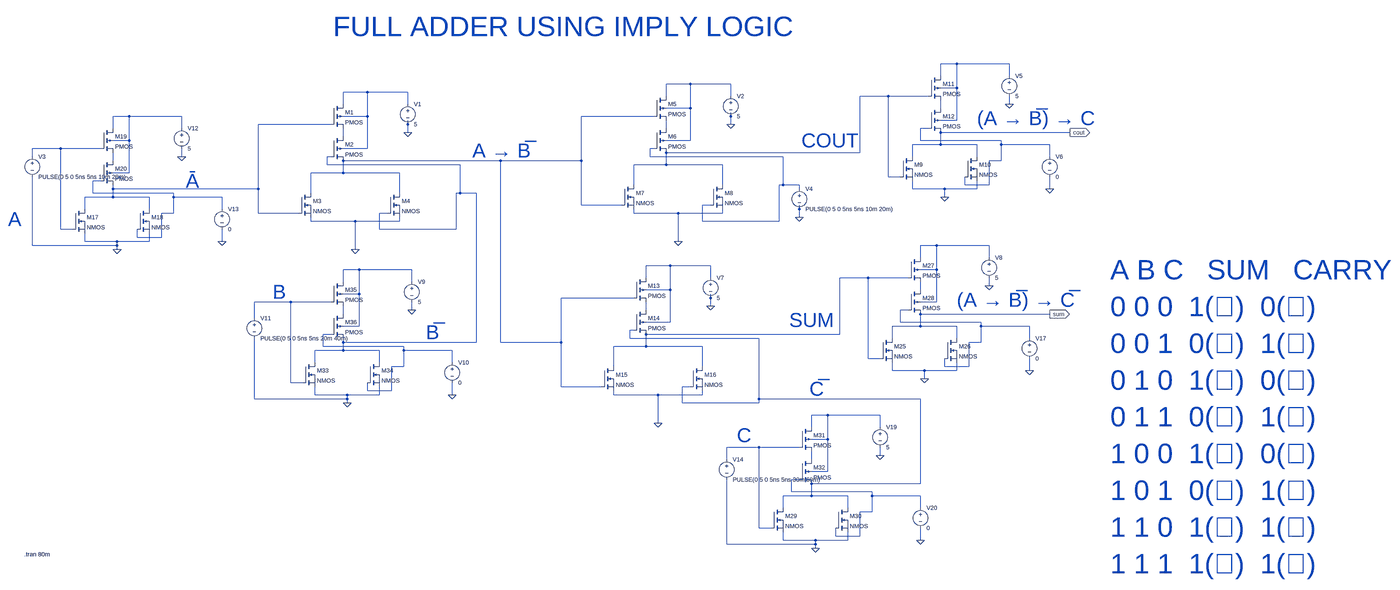
[diagram p0: schematic originalfulladderimply.asc, whole sheet]
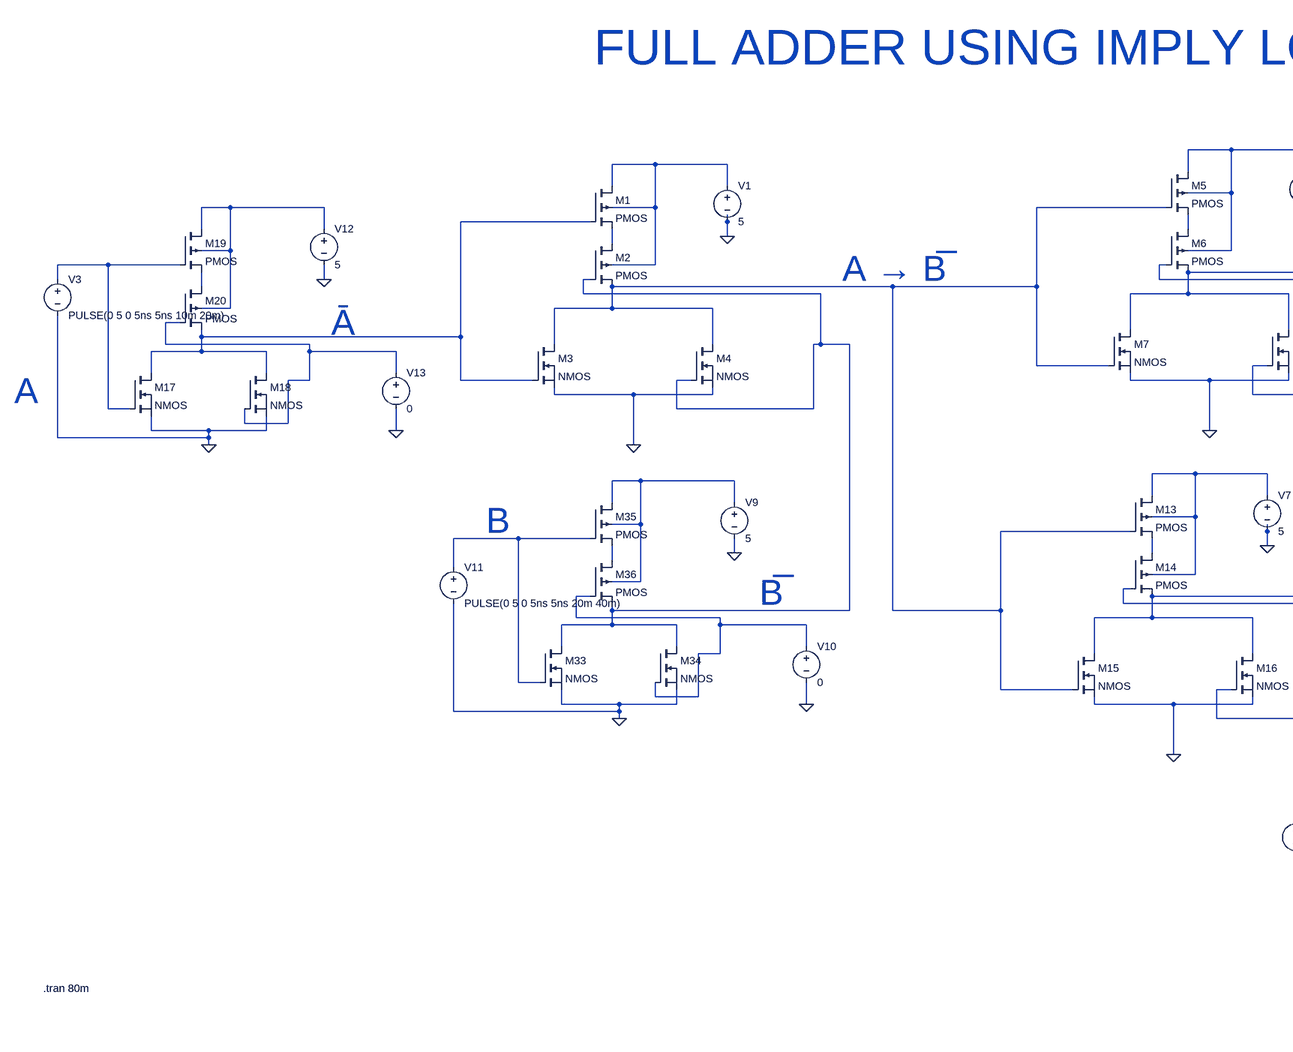
[diagram p1: schematic originalfulladderimply.asc, part, row 1 of 1, column 1 of 2]
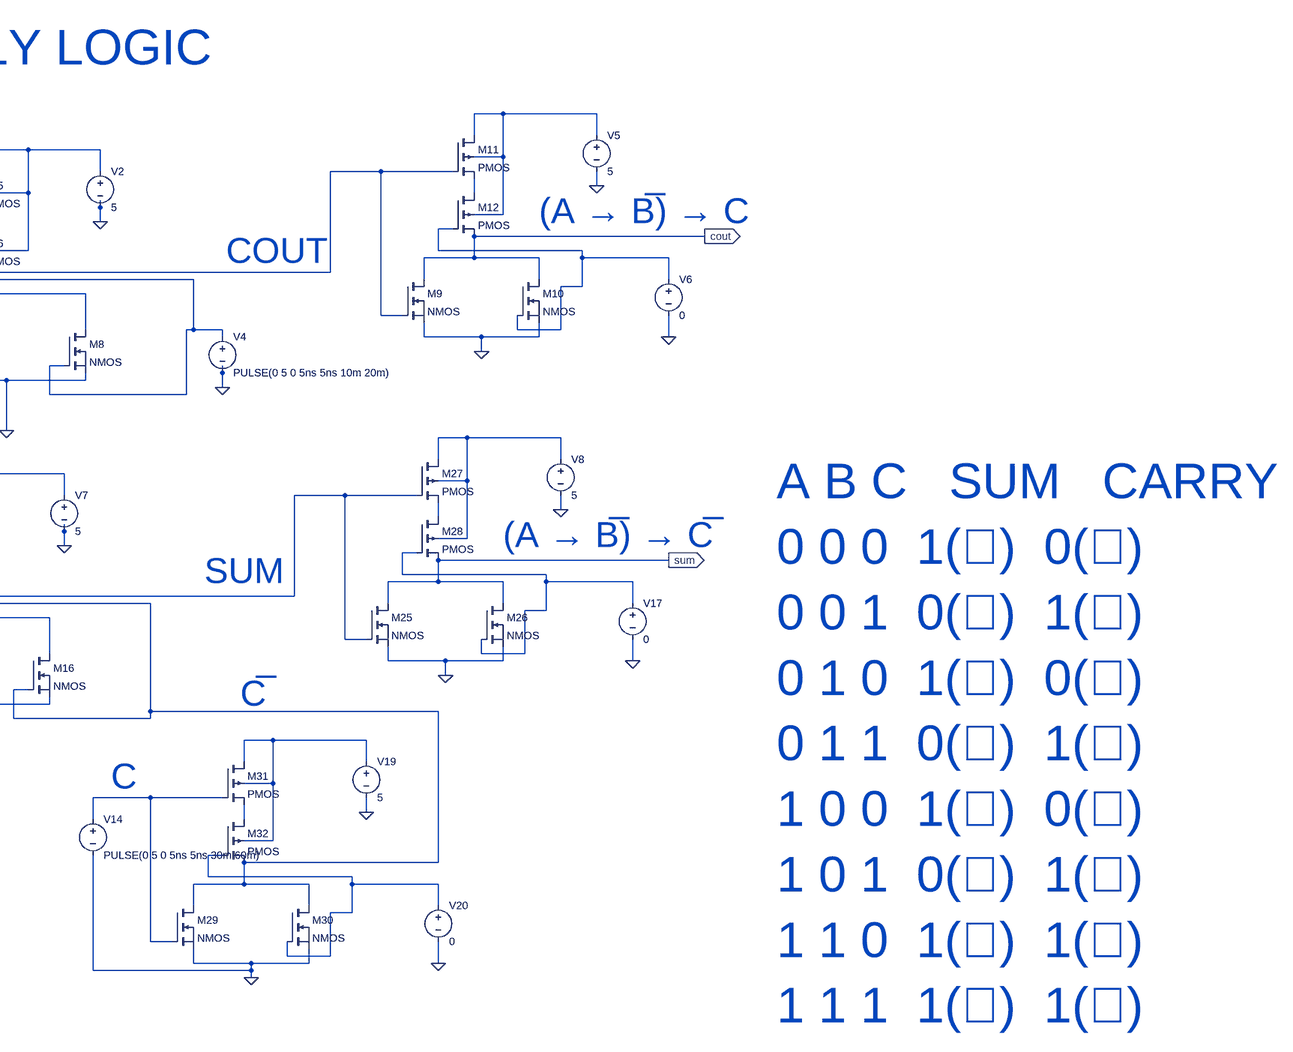
[diagram p2: schematic originalfulladderimply.asc, part, row 1 of 1, column 2 of 2]
originalfulladderimply.asc, the LTspice schematic file:
Version 4
SHEET 1 4968 3320
WIRE 1360 -464 1296 -464
WIRE 1568 -464 1360 -464
WIRE 1296 -416 1296 -464
WIRE 1568 -416 1568 -464
WIRE 304 -384 208 -384
WIRE 464 -384 304 -384
WIRE 1360 -368 1360 -464
WIRE 1360 -368 1296 -368
WIRE -976 -352 -1072 -352
WIRE -816 -352 -976 -352
WIRE 208 -336 208 -384
WIRE 464 -336 464 -384
WIRE 1088 -336 976 -336
WIRE 1248 -336 1088 -336
WIRE -1072 -304 -1072 -352
WIRE -816 -304 -816 -352
WIRE 1568 -304 1568 -336
WIRE 304 -288 304 -384
WIRE 304 -288 208 -288
WIRE 1296 -288 1296 -320
WIRE -1920 -256 -1984 -256
WIRE -1712 -256 -1920 -256
WIRE -976 -256 -976 -352
WIRE -976 -256 -1072 -256
WIRE 160 -256 -128 -256
WIRE 464 -256 464 -272
WIRE 1360 -240 1360 -368
WIRE 1360 -240 1296 -240
WIRE -1120 -224 -1408 -224
WIRE -816 -224 -816 -240
WIRE 464 -224 464 -256
WIRE -1984 -208 -1984 -256
WIRE -1712 -208 -1712 -256
WIRE 208 -208 208 -240
WIRE 1248 -208 1216 -208
WIRE -816 -192 -816 -224
WIRE 1808 -192 1296 -192
WIRE -1072 -176 -1072 -208
WIRE -1920 -160 -1920 -256
WIRE -1920 -160 -1984 -160
WIRE 304 -160 304 -288
WIRE 304 -160 208 -160
WIRE 1216 -160 1216 -208
WIRE 1536 -160 1216 -160
WIRE 1296 -144 1296 -192
WIRE 1296 -144 1184 -144
WIRE 1440 -144 1296 -144
WIRE 1536 -144 1536 -160
WIRE 1728 -144 1536 -144
WIRE -2192 -128 -2304 -128
WIRE -2032 -128 -2192 -128
WIRE -976 -128 -976 -256
WIRE -976 -128 -1072 -128
WIRE 160 -128 144 -128
WIRE 976 -112 976 -336
WIRE 976 -112 208 -112
WIRE -2304 -96 -2304 -128
WIRE -1712 -96 -1712 -128
WIRE -1120 -96 -1136 -96
WIRE 144 -96 144 -128
WIRE 672 -96 144 -96
WIRE 1184 -96 1184 -144
WIRE 1440 -96 1440 -144
WIRE 1728 -96 1728 -144
WIRE -1984 -80 -1984 -112
WIRE -448 -80 -1072 -80
WIRE -128 -80 -128 -256
WIRE -128 -80 -448 -80
WIRE 1536 -80 1536 -144
WIRE 1536 -80 1488 -80
WIRE -1136 -64 -1136 -96
WIRE -608 -64 -1136 -64
WIRE 208 -64 208 -112
WIRE 208 -64 80 -64
WIRE 432 -64 208 -64
WIRE -1920 -32 -1920 -160
WIRE -1920 -32 -1984 -32
WIRE -1072 -32 -1072 -80
WIRE -1072 -32 -1200 -32
WIRE -848 -32 -1072 -32
WIRE 1088 -16 1088 -336
WIRE 1136 -16 1088 -16
WIRE -2032 0 -2064 0
WIRE 80 16 80 -64
WIRE 432 16 432 -64
WIRE 672 16 672 -96
WIRE 672 16 656 16
WIRE 736 16 672 16
WIRE 1392 16 1392 -16
WIRE 1488 16 1488 -80
WIRE 1488 16 1392 16
WIRE -1984 32 -1984 16
WIRE -1408 32 -1408 -224
WIRE -1408 32 -1984 32
WIRE 736 32 736 16
WIRE 1184 32 1184 0
WIRE 1312 32 1184 32
WIRE 1440 32 1440 0
WIRE 1440 32 1312 32
WIRE 1728 32 1728 -16
WIRE -2064 48 -2064 0
WIRE -1744 48 -2064 48
WIRE -1200 48 -1200 -32
WIRE -848 48 -848 -32
WIRE -608 48 -608 -64
WIRE -608 48 -624 48
WIRE -544 48 -608 48
WIRE -1984 64 -1984 32
WIRE -1984 64 -2096 64
WIRE -1840 64 -1984 64
WIRE -1744 64 -1744 48
WIRE -1552 64 -1744 64
WIRE 1312 64 1312 32
WIRE -128 96 -128 -80
WIRE 32 96 -128 96
WIRE 384 96 352 96
WIRE -2096 112 -2096 64
WIRE -1840 112 -1840 64
WIRE -1552 112 -1552 64
WIRE 736 112 736 96
WIRE -1744 128 -1744 64
WIRE -1744 128 -1792 128
WIRE -1408 128 -1408 32
WIRE -1248 128 -1408 128
WIRE -896 128 -928 128
WIRE 80 128 80 112
WIRE 256 128 80 128
WIRE 432 128 432 112
WIRE 432 128 256 128
WIRE 736 144 736 112
WIRE -1200 160 -1200 144
WIRE -1024 160 -1200 160
WIRE -848 160 -848 144
WIRE -848 160 -1024 160
WIRE 352 160 352 96
WIRE 656 160 656 16
WIRE 656 160 352 160
WIRE -2192 192 -2192 -128
WIRE -2144 192 -2192 192
WIRE -928 192 -928 128
WIRE -624 192 -624 48
WIRE -624 192 -928 192
WIRE -1888 224 -1888 192
WIRE -1792 224 -1792 128
WIRE -1792 224 -1888 224
WIRE -2096 240 -2096 208
WIRE -1968 240 -2096 240
WIRE -1840 240 -1840 208
WIRE -1840 240 -1968 240
WIRE -1552 240 -1552 192
WIRE 256 240 256 128
WIRE -2304 256 -2304 -16
WIRE -1968 256 -1968 240
WIRE -1968 256 -2304 256
WIRE 1280 256 1216 256
WIRE 1488 256 1280 256
WIRE -1968 272 -1968 256
WIRE -1024 272 -1024 160
WIRE 1216 304 1216 256
WIRE 1488 304 1488 256
WIRE 224 336 128 336
WIRE 384 336 224 336
WIRE -1008 352 -1072 352
WIRE -800 352 -1008 352
WIRE 1280 352 1280 256
WIRE 1280 352 1216 352
WIRE 128 384 128 336
WIRE 384 384 384 336
WIRE 1008 384 896 384
WIRE 1168 384 1008 384
WIRE -1072 400 -1072 352
WIRE -800 400 -800 352
WIRE 1488 416 1488 384
WIRE 224 432 224 336
WIRE 224 432 128 432
WIRE 1216 432 1216 400
WIRE -1008 448 -1008 352
WIRE -1008 448 -1072 448
WIRE 80 464 -208 464
WIRE 384 464 384 448
WIRE -1280 480 -1424 480
WIRE -1120 480 -1280 480
WIRE 1280 480 1280 352
WIRE 1280 480 1216 480
WIRE 384 496 384 464
WIRE -800 512 -800 480
WIRE 128 512 128 480
WIRE 1168 512 1136 512
WIRE -1072 528 -1072 496
WIRE 1728 528 1216 528
WIRE -1424 544 -1424 480
WIRE 224 560 224 432
WIRE 224 560 128 560
WIRE 1136 560 1136 512
WIRE 1456 560 1136 560
WIRE -1008 576 -1008 448
WIRE -1008 576 -1072 576
WIRE 1216 576 1216 528
WIRE 1216 576 1104 576
WIRE 1360 576 1216 576
WIRE 1456 576 1456 560
WIRE 1648 576 1456 576
WIRE 80 592 64 592
WIRE -1120 608 -1152 608
WIRE 896 608 896 384
WIRE 896 608 128 608
WIRE 64 624 64 592
WIRE 576 624 64 624
WIRE 1104 624 1104 576
WIRE 1360 624 1360 576
WIRE 1648 624 1648 576
WIRE -1072 640 -1072 624
WIRE -544 640 -544 48
WIRE -544 640 -1072 640
WIRE -448 640 -448 -80
WIRE -208 640 -208 464
WIRE -208 640 -448 640
WIRE 1456 640 1456 576
WIRE 1456 640 1408 640
WIRE -1152 656 -1152 608
WIRE -832 656 -1152 656
WIRE 128 656 128 608
WIRE 128 656 0 656
WIRE 352 656 128 656
WIRE -1072 672 -1072 640
WIRE -1072 672 -1184 672
WIRE -928 672 -1072 672
WIRE -832 672 -832 656
WIRE -640 672 -832 672
WIRE 1008 704 1008 384
WIRE 1056 704 1008 704
WIRE -1184 720 -1184 672
WIRE -928 720 -928 672
WIRE -640 720 -640 672
WIRE -832 736 -832 672
WIRE -832 736 -880 736
WIRE 0 736 0 656
WIRE 352 736 352 656
WIRE 1312 736 1312 704
WIRE 1408 736 1408 640
WIRE 1408 736 1312 736
WIRE 1104 752 1104 720
WIRE 1232 752 1104 752
WIRE 1360 752 1360 720
WIRE 1360 752 1232 752
WIRE 1648 752 1648 704
WIRE 1232 784 1232 752
WIRE -1280 800 -1280 480
WIRE -1232 800 -1280 800
WIRE -208 816 -208 640
WIRE -48 816 -208 816
WIRE 304 816 272 816
WIRE -976 832 -976 800
WIRE -880 832 -880 736
WIRE -880 832 -976 832
WIRE -1184 848 -1184 816
WIRE -1056 848 -1184 848
WIRE -928 848 -928 816
WIRE -928 848 -1056 848
WIRE -640 848 -640 800
WIRE 0 848 0 832
WIRE 176 848 0 848
WIRE 352 848 352 832
WIRE 352 848 176 848
WIRE -1424 864 -1424 624
WIRE -1056 864 -1056 848
WIRE -1056 864 -1424 864
WIRE 576 864 576 624
WIRE 1216 864 576 864
WIRE -1056 880 -1056 864
WIRE 272 880 272 816
WIRE 576 880 576 864
WIRE 576 880 272 880
WIRE 848 928 784 928
WIRE 1056 928 848 928
WIRE 176 960 176 848
WIRE 784 976 784 928
WIRE 1056 976 1056 928
WIRE 848 1024 848 928
WIRE 848 1024 784 1024
WIRE 576 1056 448 1056
WIRE 736 1056 576 1056
WIRE 1056 1088 1056 1056
WIRE 448 1104 448 1056
WIRE 784 1104 784 1072
WIRE 848 1152 848 1024
WIRE 848 1152 784 1152
WIRE 736 1184 704 1184
WIRE 1216 1200 1216 864
WIRE 1216 1200 784 1200
WIRE 704 1232 704 1184
WIRE 1024 1232 704 1232
WIRE 784 1248 784 1200
WIRE 784 1248 672 1248
WIRE 928 1248 784 1248
WIRE 1024 1248 1024 1232
WIRE 1216 1248 1024 1248
WIRE 672 1296 672 1248
WIRE 928 1296 928 1248
WIRE 1216 1296 1216 1248
WIRE 1024 1312 1024 1248
WIRE 1024 1312 976 1312
WIRE 576 1376 576 1056
WIRE 624 1376 576 1376
WIRE 880 1408 880 1376
WIRE 976 1408 976 1312
WIRE 976 1408 880 1408
WIRE 672 1424 672 1392
WIRE 800 1424 672 1424
WIRE 928 1424 928 1392
WIRE 928 1424 800 1424
WIRE 1216 1424 1216 1376
WIRE 448 1440 448 1184
WIRE 800 1440 800 1424
WIRE 800 1440 448 1440
WIRE 800 1456 800 1440
FLAG -1712 -96 0
FLAG -1968 272 0
FLAG -1552 240 0
FLAG -1024 272 0
FLAG -816 -192 0
FLAG 256 240 0
FLAG 736 144 0
FLAG 464 -224 0
FLAG 1568 -304 0
FLAG 1312 64 0
FLAG 1728 32 0
FLAG 176 960 0
FLAG 384 496 0
FLAG 1488 416 0
FLAG 1232 784 0
FLAG 1648 752 0
FLAG 1056 1088 0
FLAG 800 1456 0
FLAG 1216 1424 0
FLAG 1808 -192 cout
IOPIN 1808 -192 Out
FLAG 1728 528 sum
IOPIN 1728 528 Out
FLAG -800 512 0
FLAG -1056 880 0
FLAG -640 848 0
SYMBOL nmos -2144 112 R0
SYMATTR InstName M17
SYMBOL voltage -1712 -224 R0
WINDOW 123 0 0 Left 0
WINDOW 39 0 0 Left 0
SYMATTR InstName V12
SYMATTR Value 5
SYMBOL voltage -1552 96 R0
WINDOW 123 0 0 Left 0
WINDOW 39 0 0 Left 0
SYMATTR InstName V13
SYMATTR Value 0
SYMBOL nmos -1888 112 R0
SYMATTR InstName M18
SYMBOL pmos4 -2032 -208 R0
SYMATTR InstName M19
SYMBOL pmos4 -2032 -80 R0
SYMATTR InstName M20
SYMBOL pmos4 -1120 -304 R0
SYMATTR InstName M1
SYMBOL pmos4 -1120 -176 R0
SYMATTR InstName M2
SYMBOL nmos -1248 48 R0
SYMATTR InstName M3
SYMBOL nmos -896 48 R0
SYMATTR InstName M4
SYMBOL voltage -816 -320 R0
WINDOW 123 0 0 Left 0
WINDOW 39 0 0 Left 0
SYMATTR InstName V1
SYMATTR Value 5
SYMBOL pmos4 160 -336 R0
SYMATTR InstName M5
SYMBOL pmos4 160 -208 R0
SYMATTR InstName M6
SYMBOL nmos 32 16 R0
SYMATTR InstName M7
SYMBOL nmos 384 16 R0
SYMATTR InstName M8
SYMBOL voltage 464 -352 R0
WINDOW 123 0 0 Left 0
WINDOW 39 0 0 Left 0
SYMATTR InstName V2
SYMATTR Value 5
SYMBOL voltage 736 16 R0
WINDOW 123 0 0 Left 0
WINDOW 39 0 0 Left 0
SYMATTR InstName V4
SYMATTR Value PULSE(0 5 0 5ns 5ns 10m 20m)
SYMBOL nmos 1136 -96 R0
SYMATTR InstName M9
SYMBOL voltage 1568 -432 R0
WINDOW 123 0 0 Left 0
WINDOW 39 0 0 Left 0
SYMATTR InstName V5
SYMATTR Value 5
SYMBOL voltage 1728 -112 R0
WINDOW 123 0 0 Left 0
WINDOW 39 0 0 Left 0
SYMATTR InstName V6
SYMATTR Value 0
SYMBOL nmos 1392 -96 R0
SYMATTR InstName M10
SYMBOL pmos4 1248 -416 R0
SYMATTR InstName M11
SYMBOL pmos4 1248 -288 R0
SYMATTR InstName M12
SYMBOL pmos4 80 384 R0
SYMATTR InstName M13
SYMBOL pmos4 80 512 R0
SYMATTR InstName M14
SYMBOL nmos -48 736 R0
SYMATTR InstName M15
SYMBOL nmos 304 736 R0
SYMATTR InstName M16
SYMBOL voltage 384 368 R0
WINDOW 123 0 0 Left 0
WINDOW 39 0 0 Left 0
SYMATTR InstName V7
SYMATTR Value 5
SYMBOL nmos 1056 624 R0
SYMATTR InstName M25
SYMBOL voltage 1488 288 R0
WINDOW 123 0 0 Left 0
WINDOW 39 0 0 Left 0
SYMATTR InstName V8
SYMATTR Value 5
SYMBOL voltage 1648 608 R0
WINDOW 123 0 0 Left 0
WINDOW 39 0 0 Left 0
SYMATTR InstName V17
SYMATTR Value 0
SYMBOL nmos 1312 624 R0
SYMATTR InstName M26
SYMBOL pmos4 1168 304 R0
SYMATTR InstName M27
SYMBOL pmos4 1168 432 R0
SYMATTR InstName M28
SYMBOL nmos 624 1296 R0
SYMATTR InstName M29
SYMBOL voltage 1056 960 R0
WINDOW 123 0 0 Left 0
WINDOW 39 0 0 Left 0
SYMATTR InstName V19
SYMATTR Value 5
SYMBOL voltage 1216 1280 R0
WINDOW 123 0 0 Left 0
WINDOW 39 0 0 Left 0
SYMATTR InstName V20
SYMATTR Value 0
SYMBOL nmos 880 1296 R0
SYMATTR InstName M30
SYMBOL pmos4 736 976 R0
SYMATTR InstName M31
SYMBOL pmos4 736 1104 R0
SYMATTR InstName M32
SYMBOL nmos -1232 720 R0
SYMATTR InstName M33
SYMBOL voltage -800 384 R0
WINDOW 123 0 0 Left 0
WINDOW 39 0 0 Left 0
SYMATTR InstName V9
SYMATTR Value 5
SYMBOL voltage -640 704 R0
WINDOW 123 0 0 Left 0
WINDOW 39 0 0 Left 0
SYMATTR InstName V10
SYMATTR Value 0
SYMBOL nmos -976 720 R0
SYMATTR InstName M34
SYMBOL pmos4 -1120 400 R0
SYMATTR InstName M35
SYMBOL pmos4 -1120 528 R0
SYMATTR InstName M36
SYMBOL voltage -2304 -112 R0
WINDOW 123 0 0 Left 0
WINDOW 39 0 0 Left 0
SYMATTR InstName V3
SYMATTR Value PULSE(0 5 0 5ns 5ns 10m 20m)
SYMBOL voltage -1424 528 R0
WINDOW 123 0 0 Left 0
WINDOW 39 0 0 Left 0
SYMATTR InstName V11
SYMATTR Value PULSE(0 5 0 5ns 5ns 20m 40m)
SYMBOL voltage 448 1088 R0
WINDOW 123 0 0 Left 0
WINDOW 39 0 0 Left 0
SYMATTR InstName V14
SYMATTR Value PULSE(0 5 0 5ns 5ns 30m 60m)
TEXT -2336 1480 Left 2 !.tran 80m
TEXT -2400 152 Left 6 ;A
TEXT -1696 0 Left 6 ;Ā
TEXT -744 600 Left 6 ;B̅
TEXT -1352 440 Left 6 ;B
TEXT 776 824 Left 6 ;C̅
TEXT -560 -120 Left 6 ;A → B̅
TEXT 1440 -248 Left 6 ;(A → B̅) → C
TEXT 1360 472 Left 6 ;(A → B̅) → C̅
TEXT 696 552 Left 6 ;SUM
TEXT -1112 -824 Left 7 ;FULL ADDER USING IMPLY LOGIC
TEXT 744 -160 Left 6 ;COUT
TEXT 488 1008 Left 6 ;C
TEXT 1968 352 Left 7 ;A B C   SUM   CARRY\n0 0 0  1(❌)  0(✔)\n0 0 1  0(❌)  1(❌)\n0 1 0  1(✔)  0(✔)\n0 1 1  0(✔)  1(✔)\n1 0 0  1(✔)  0(✔)\n1 0 1  0(✔)  1(✔)\n1 1 0  1(❌)  1(✔)\n1 1 1  1(✔)  1(✔)

The netlist it stands for:
* originalfulladderimply.asc
M17 N008 N012 0 0 NMOS
V12 N006 0 5
V13 N016 0 0
M18 N008 N016 0 0 NMOS
M19 N006 N012 N015 N006 PMOS
M20 N015 N016 N008 N006 PMOS
M1 N003 N008 N011 N003 PMOS
M2 N011 N014 N007 N003 PMOS
M3 N007 N008 0 0 NMOS
M4 N007 N014 0 0 NMOS
V1 N003 0 5
M5 N002 N007 N009 N002 PMOS
M6 N009 N013 N004 N002 PMOS
M7 N004 N007 0 0 NMOS
M8 N004 N013 0 0 NMOS
V2 N002 0 5
V4 N013 0 PULSE(0 5 0 5ns 5ns 10m 20m)
M9 cout N004 0 0 NMOS
V5 N001 0 5
V6 N010 0 0
M10 cout N010 0 0 NMOS
M11 N001 N004 N005 N001 PMOS
M12 N005 N010 cout N001 PMOS
M13 N018 N007 N023 N018 PMOS
M14 N023 N026 N020 N018 PMOS
M15 N020 N007 0 0 NMOS
M16 N020 N026 0 0 NMOS
V7 N018 0 5
M25 sum N020 0 0 NMOS
V8 N017 0 5
V17 N024 0 0
M26 sum N024 0 0 NMOS
M27 N017 N020 N021 N017 PMOS
M28 N021 N024 sum N017 PMOS
M29 N026 N029 0 0 NMOS
V19 N028 0 5
V20 N031 0 0
M30 N026 N031 0 0 NMOS
M31 N028 N029 N030 N028 PMOS
M32 N030 N031 N026 N028 PMOS
M33 N014 N022 0 0 NMOS
V9 N019 0 5
V10 N027 0 0
M34 N014 N027 0 0 NMOS
M35 N019 N022 N025 N019 PMOS
M36 N025 N027 N014 N019 PMOS
V3 N012 0 PULSE(0 5 0 5ns 5ns 10m 20m)
V11 N022 0 PULSE(0 5 0 5ns 5ns 20m 40m)
V14 N029 0 PULSE(0 5 0 5ns 5ns 30m 60m)
.model NMOS NMOS
.model PMOS PMOS
.lib standard.mos
.tran 80m
* A
* Ā
* B̅
* B
* C̅
* A → B̅
* (A → B̅) → C
* (A → B̅) → C̅
* SUM
* FULL ADDER USING IMPLY LOGIC
* COUT
* C
* A B C   SUM   CARRY
* 0 0 0  1(❌)  0(✔)
* 0 0 1  0(❌)  1(❌)
* 0 1 0  1(✔)  0(✔)
* 0 1 1  0(✔)  1(✔)
* 1 0 0  1(✔)  0(✔)
* 1 0 1  0(✔)  1(✔)
* 1 1 0  1(❌)  1(✔)
* 1 1 1  1(✔)  1(✔)
.backanno
.end